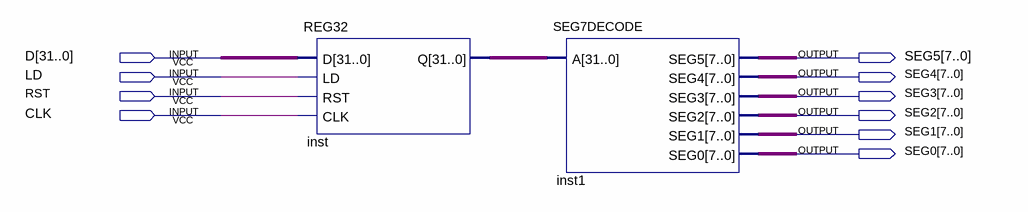
[diagram p0: schematic sheet]
// Quartus schematic SEG7.bdf as structural Verilog: 2 symbols, 10 pins
module SEG7 (
  input  [31:0] D,
  input  LD,
  input  RST,
  input  CLK,
  output [7:0] SEG5,
  output [7:0] SEG4,
  output [7:0] SEG3,
  output [7:0] SEG2,
  output [7:0] SEG1,
  output [7:0] SEG0
);

  wire [31:0] inst_q;

  REG32 inst (.D(D), .LD(LD), .RST(RST), .CLK(CLK), .Q(inst_q));
  SEG7DECODE inst1 (.A(inst_q), .SEG5(SEG5), .SEG4(SEG4), .SEG3(SEG3), .SEG2(SEG2), .SEG1(SEG1), .SEG0(SEG0));
endmodule
